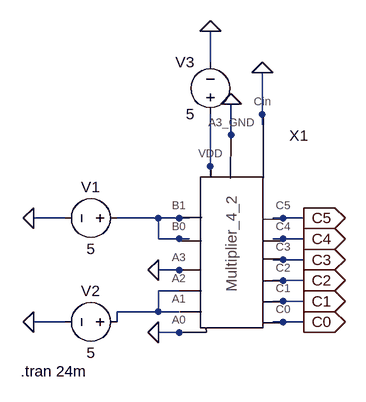
[diagram p0: schematic Draft4.asc]
Draft4.asc, the LTspice schematic file:
Version 4
SHEET 1 880 680
WIRE 192 -32 192 -80
WIRE 272 48 272 -16
WIRE 272 64 272 48
WIRE 224 80 224 32
WIRE 224 96 224 80
WIRE 192 128 192 48
WIRE 192 144 192 128
WIRE -32 208 -80 208
WIRE 112 208 48 208
WIRE 144 208 112 208
WIRE 160 208 144 208
WIRE 304 208 288 208
WIRE 336 208 304 208
WIRE 112 240 112 208
WIRE 144 240 112 240
WIRE 160 240 144 240
WIRE 304 240 288 240
WIRE 336 240 304 240
WIRE 304 272 288 272
WIRE 336 272 304 272
WIRE 144 288 112 288
WIRE 160 288 144 288
WIRE 304 304 288 304
WIRE 336 304 304 304
WIRE 144 320 112 320
WIRE 304 336 288 336
WIRE 336 336 304 336
WIRE 112 352 112 320
WIRE 112 352 48 352
WIRE 144 352 112 352
WIRE -32 368 -80 368
WIRE 48 368 48 352
WIRE 304 368 288 368
WIRE 336 368 304 368
WIRE 144 384 112 384
WIRE 160 384 144 384
FLAG 272 -16 0
FLAG 192 -80 0
FLAG -80 208 0
FLAG -80 368 0
FLAG 336 208 C5
IOPIN 336 208 Out
FLAG 336 240 C4
IOPIN 336 240 Out
FLAG 336 272 C3
IOPIN 336 272 Out
FLAG 336 304 C2
IOPIN 336 304 Out
FLAG 336 336 C1
IOPIN 336 336 Out
FLAG 336 368 C0
IOPIN 336 368 Out
FLAG 112 384 0
FLAG 112 288 0
FLAG 224 32 0
SYMBOL Mult_4_2 256 240 R0
SYMATTR InstName X1
SYMBOL voltage 64 208 R90
WINDOW 0 -32 56 VBottom 2
WINDOW 3 32 56 VTop 2
WINDOW 123 0 0 Left 2
WINDOW 39 0 0 Left 2
SYMATTR InstName V1
SYMATTR Value 5
SYMBOL voltage 64 368 R90
WINDOW 0 -32 56 VBottom 2
WINDOW 3 32 56 VTop 2
WINDOW 123 0 0 Left 2
WINDOW 39 0 0 Left 2
SYMATTR InstName V2
SYMATTR Value 5
SYMBOL voltage 192 64 R180
WINDOW 0 24 96 Left 2
WINDOW 3 24 16 Left 2
WINDOW 123 0 0 Left 2
WINDOW 39 0 0 Left 2
SYMATTR InstName V3
SYMATTR Value 5
TEXT -100 444 Left 2 !.tran 24m

The netlist it stands for:
* Draft4.asc
XX1 0 N003 N003 0 N002 N002 N001 0 0 C5 C4 C3 C2 C0 C1 Mult_4_2  ; pins A0 A1 A2 A3 B0 B1 VDD A3_GND Cin C5 C4 C3 C2 C0 C1
V1 N002 0 5
V2 N003 0 5
V3 N001 0 5
.tran 24m
.backanno
.end